# EAGLE design strip_charlie_12 (EAGLE 5.11)
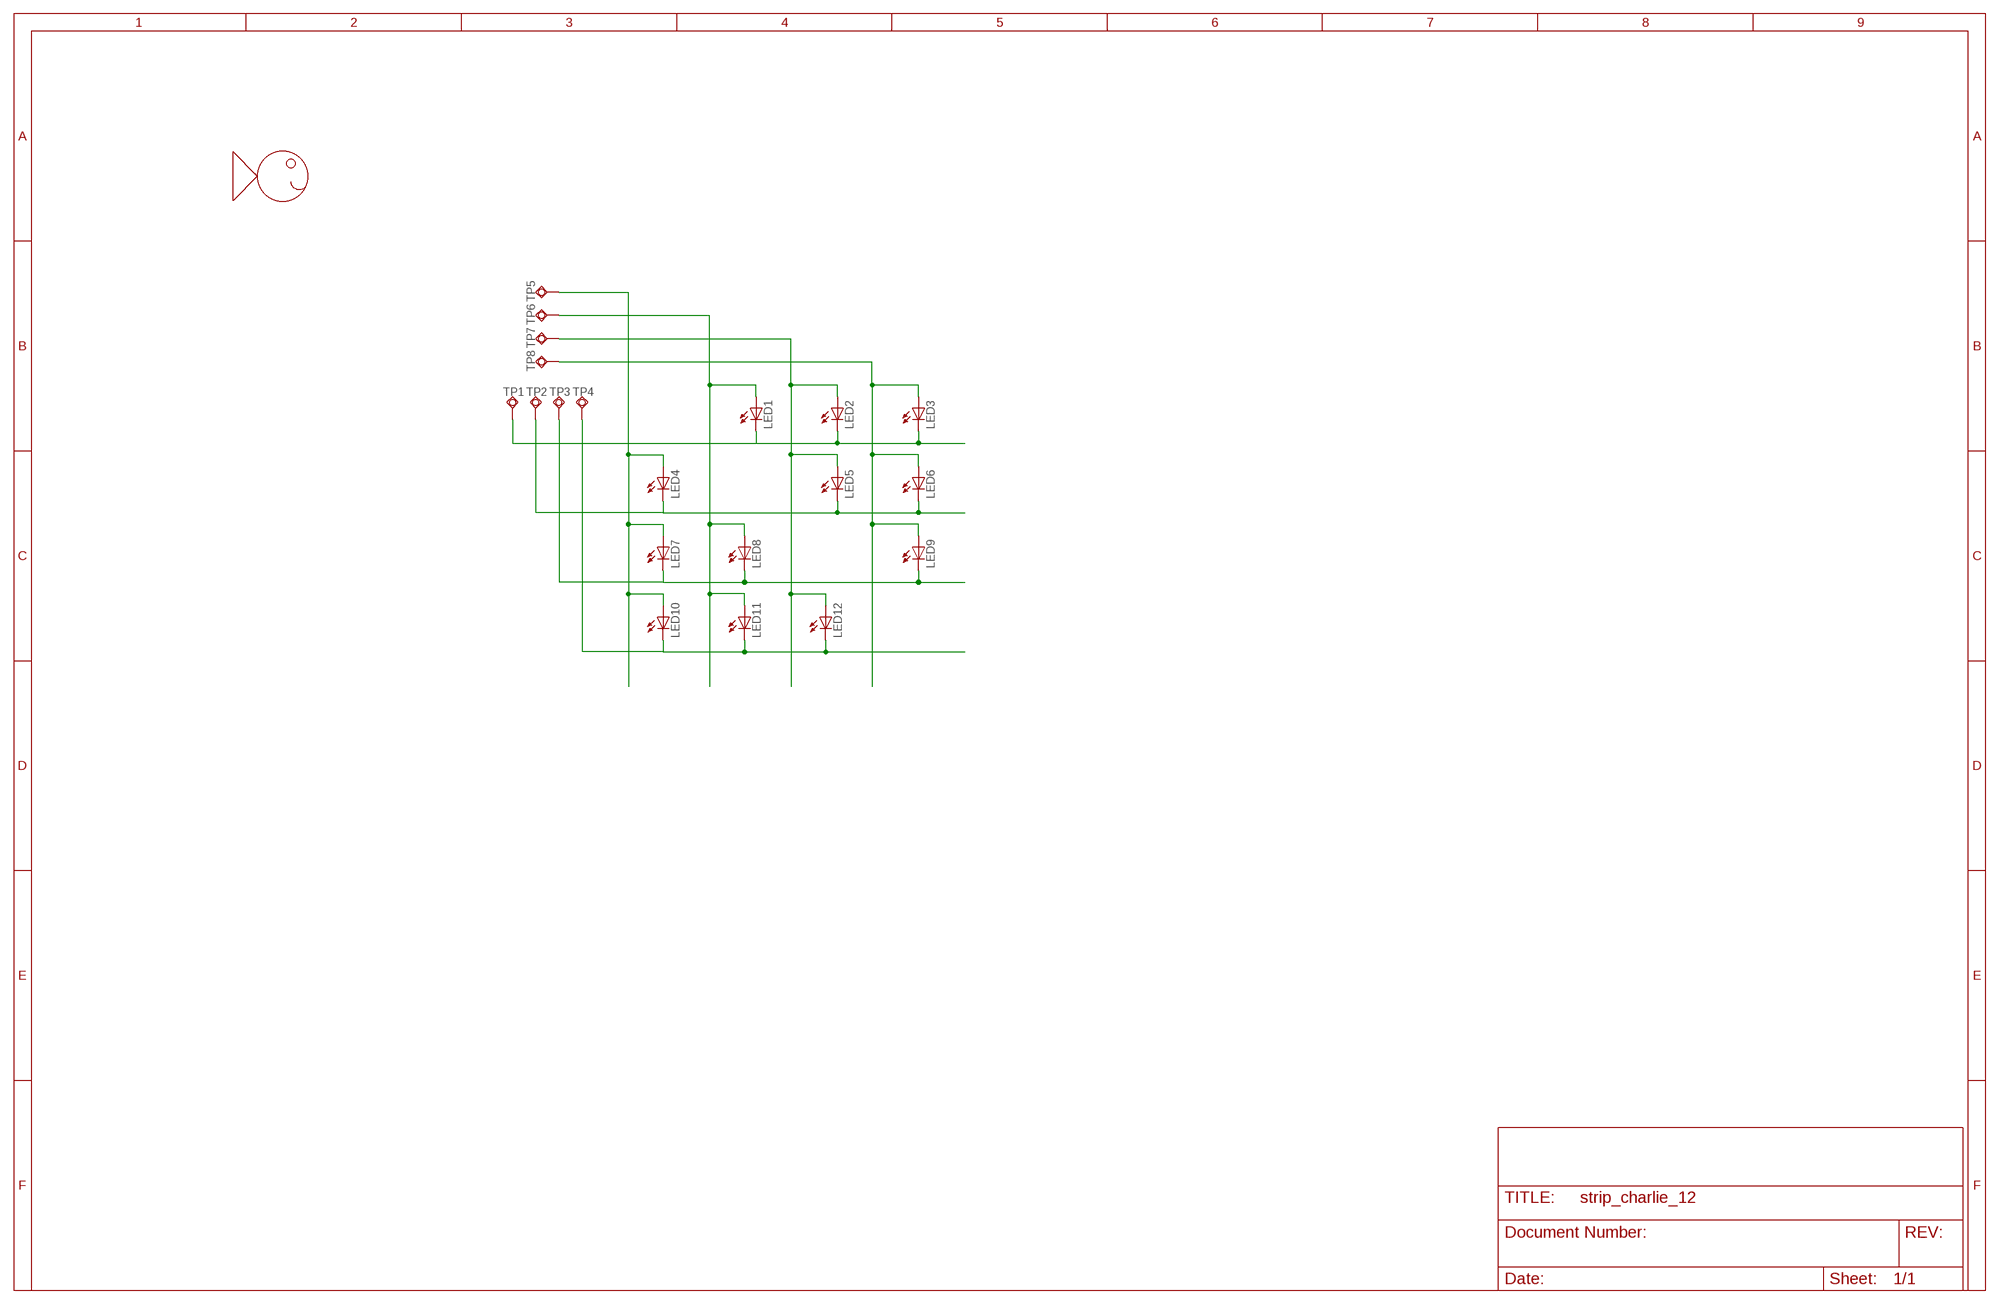
[diagram p0: schematic, sheet 1]

## Parts
LED1  LED1206  [LED-1206]
LED2  LED1206  [LED-1206]
LED3  LED1206  [LED-1206]
LED4  LED1206  [LED-1206]
LED5  LED1206  [LED-1206]
LED6  LED1206  [LED-1206]
LED7  LED1206  [LED-1206]
LED8  LED1206  [LED-1206]
LED9  LED1206  [LED-1206]
LED10  LED1206  [LED-1206]
LED11  LED1206  [LED-1206]
LED12  LED1206  [LED-1206]
TP1  TPSQTP15SQ  [TP15SQ]
TP2  TPSQTP15SQ  [TP15SQ]
TP3  TPSQTP15SQ  [TP15SQ]
TP4  TPSQTP15SQ  [TP15SQ]
TP5  TPSQTP15SQ  [TP15SQ]
TP6  TPSQTP15SQ  [TP15SQ]
TP7  TPSQTP15SQ  [TP15SQ]
TP8  TPSQTP15SQ  [TP15SQ]
U$1  FHI_LOGO  [FHI_LOGO]

## Nets
OUT1_1: LED1.C LED2.C LED3.C TP1.TP
OUT1_2: LED4.A LED7.A LED10.A TP5.TP
OUT2_1: LED4.C LED5.C LED6.C TP2.TP
OUT2_2: LED1.A LED8.A LED11.A TP6.TP
OUT3_1: LED7.C LED8.C LED9.C TP3.TP
OUT3_2: LED2.A LED5.A LED12.A TP7.TP
OUT4_1: LED10.C LED11.C LED12.C TP4.TP
OUT4_2: LED3.A LED6.A LED9.A TP8.TP

## Library data of the parts
LED1-LED12 = CyberRailGuru:LED: LEDs Standard schematic elements and footprints for 5mm, 3mm, 1206, and 0603 sized LEDs. 5mm - Spark Fun Electronics SKU : COM-00529 (and others)
TP1-TP8 = CyberRailGuru:TPSQ: Test pad
U$1 = CyberRailGuru:FHI_LOGO: Fishhead Industries Logo

## Board
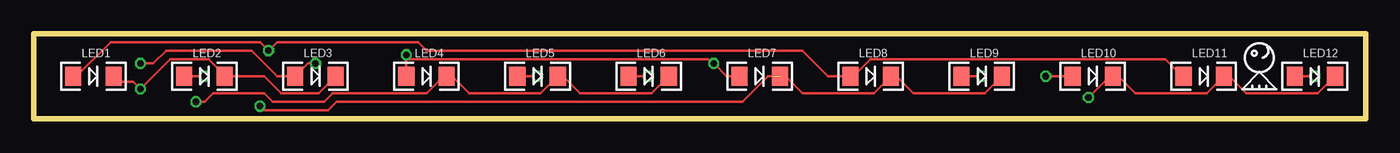
[diagram p1: board, top side]
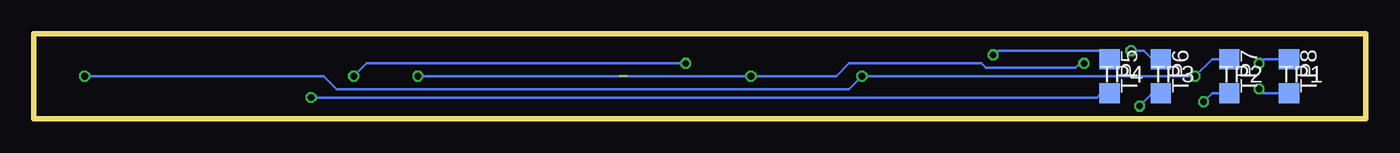
[diagram p2: board, bottom side, seen from below]

Size 99.05 x 6.34 mm. Coordinates in mm from the lower left corner, seen from the top.
Outline: 0,0 99.05,0 99.05,6.34 0,6.34 0,0
Copper layers (1*16): Top 0.035mm / dielectric 1.5mm / Bottom 0.035mm
Design rules "Fusion_eagle_rule_v1.1": minimum track width 6mil, minimum drill 12mil, track to track 6mil, track to pad 6mil, pad to pad 6mil, via to via 6mil, smd to smd 0mil, copper to edge 10mil, drill to drill 10mil, minimum pad ring 10mil, minimum via ring 6mil, stop-mask expansion 2mil, vias tented up to drill 100mil, thermal gap 10mil

### Footprints (pad centres in the part's own frame; a part is rotated, then mirrored left to right if it is on the bottom)
LED-1206 = smd 1.2 x 1.4: A -1.5,0; C 1.5,0
TP15SQ = smd 1.5 x 1.5: TP 0,0

### Placement (x,y rotation side)
LED1  4.45,3.17 0 top
LED2  12.7,3.17 0 top
LED3  20.95,3.17 0 top
LED4  29.21,3.17 0 top
LED5  37.47,3.17 0 top
LED6  45.72,3.17 0 top
LED7  53.98,3.17 0 top
LED8  62.23,3.17 0 top
LED9  70.48,3.17 0 top
LED10  78.74,3.17 0 top
LED11  87,3.17 0 top
LED12  95.25,3.17 0 top
TP1  5.71,1.91 0 bottom
TP2  10.16,1.91 0 bottom
TP3  15.24,1.91 0 bottom
TP4  19.05,1.91 0 bottom
TP5  19.05,4.45 270 bottom
TP6  15.24,4.45 270 bottom
TP7  10.16,4.45 270 bottom
TP8  5.71,4.45 270 bottom
U$1  91.12,3.49 90 top

### Tracks (layer width: path | path; a pad name or v marks a point on that pad's centre or on a via)
OUT1_1  (via drill 0.5)
  Top 0.203: LED3.C 21.18,1.91 18.41,1.91 17.14,3.17 LED2.C 14.2,3.26 13.02,4.45 10.16,4.45 v7.94,2.22 7.39,2.77 6.35,2.77 LED1.C
  Bottom 0.203: TP1.TP 7.62,1.91 v7.94,2.22
OUT1_2  (via drill 0.5)
  Top 0.203: v75.25,3.17 LED10.A | LED4.A v27.71,4.76 28.03,4.45 50.16,4.45 50.48,4.13 v50.57,4.13 51.52,3.17 LED7.A
  Bottom 0.203: v75.25,3.17 74.3,4.13 v50.57,4.13 | v27.71,4.76 27.62,4.76 27.3,5.08 19.68,5.08 TP5.TP
OUT2_1  (via drill 0.5)
  Top 0.203: LED6.C 45.95,1.91 40.64,1.91 39.37,3.17 LED5.C 37.7,1.91 32.38,1.91 31.11,3.17 LED4.C 30.48,3.17 29.21,1.91 22.23,1.91 21.59,1.27 17.78,1.27 17.14,1.91 13.34,1.91 12.7,1.27 v12.06,1.27
  Bottom 0.203: TP2.TP 11.43,1.91 v12.06,1.27
OUT2_2  (via drill 0.5)
  Top 0.203: LED1.A 3.17,3.17 5.71,5.71 16.83,5.71 v17.46,5.08 18.1,5.71 28.57,5.71 29.21,5.08 57.15,5.08 59.05,3.17 LED8.A 60.96,3.17 62.23,4.45 84.14,4.45 85.41,3.17 LED11.A
  Bottom 0.203: v17.46,5.08 16.51,5.08 15.88,4.45 TP6.TP
OUT3_1  (via drill 0.5)  (1 unrouted)
  Top 0.203: LED9.C 70.72,1.91 65.41,1.91 64.14,3.17 LED8.C 62.46,1.91 57.15,1.91 55.88,3.17 LED7.C | v16.83,0.95 17.14,0.64 21.91,0.64 22.54,1.27 52.7,1.27 54.61,3.17 54.93,3.17
  Bottom 0.203: TP3.TP 15.88,1.91 v16.83,0.95
OUT3_2  (via drill 0.5)
  Top 0.203: v95.25,3.17 LED12.A | v37.47,3.17 LED5.A | v12.7,3.17 LED2.A 11.43,3.4 11.43,3.17
  Bottom 0.203: v95.25,3.17 77.47,3.17 76.52,2.22 38.42,2.22 v37.47,3.17 v12.7,3.17 11.43,4.45 TP7.TP
OUT4_1  (via drill 0.5)
  Top 0.203: LED12.C 95.48,1.91 90.17,1.91 88.9,3.17 LED11.C 87.22,1.91 81.92,1.91 80.64,3.17 LED10.C 80.01,3.17 v78.42,1.59
  Bottom 0.203: TP4.TP 19.68,1.91 20,1.59 v78.42,1.59
OUT4_2  (via drill 0.5)
  Top 0.203: LED6.A 44.45,3.17 | LED6.A 44.22,3.4 | v70.48,3.17 LED9.A | v45.72,3.17 LED6.A | v7.94,4.13 8.89,4.13 9.84,5.08 16.19,5.08 18.1,3.17 LED3.A 20.41,4.13 v20.95,4.13
  Bottom 0.203: v70.48,3.17 v45.72,3.17 LED6.A 39.37,3.17 38.42,4.13 28.57,4.13 28.26,3.81 21.59,3.81 21.27,4.13 v20.95,4.13 | TP8.TP 7.62,4.45 v7.94,4.13

### Text on the board
Document: v1.0 | Fishhead Industries | (c) 2012